# EAGLE design atmega328pb_stamp (EAGLE 7.7.0)
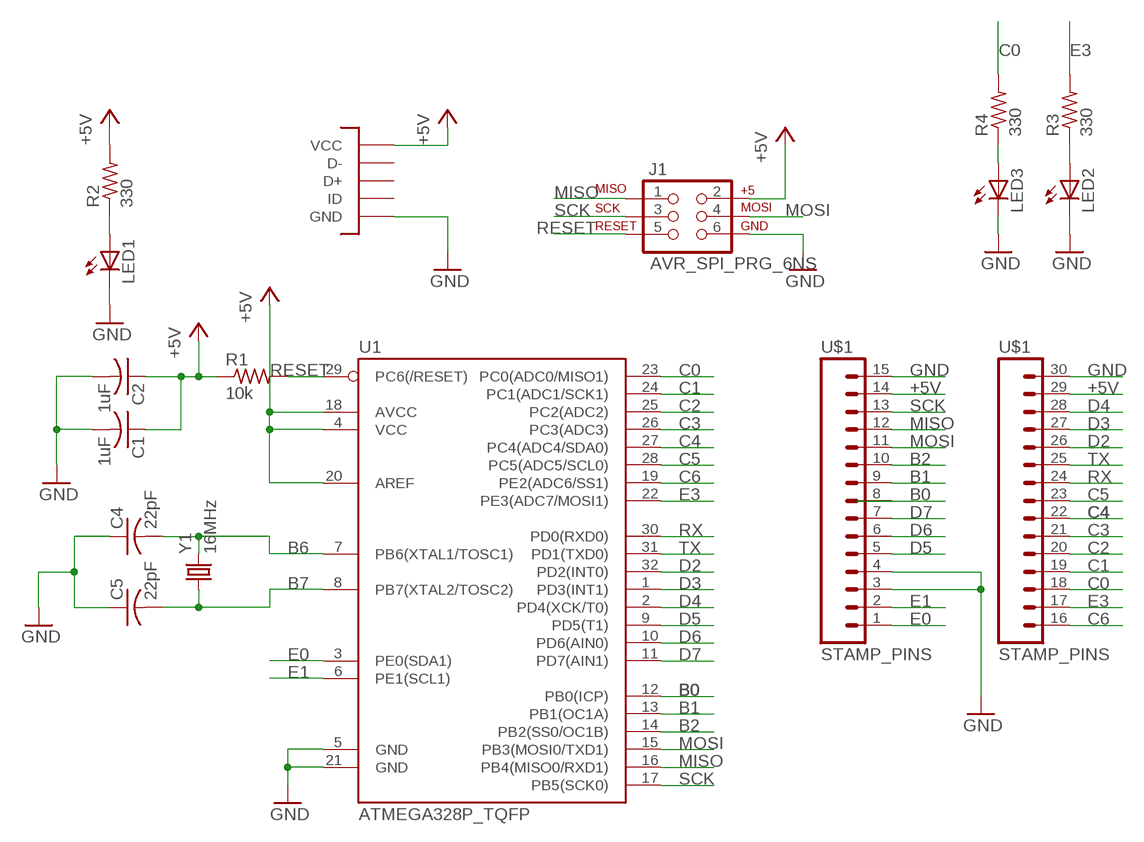
[diagram p0: schematic, sheet 1]

## Parts
C1  1uF  C-USC0603  [C0603]
C2  1uF  C-USC0603  [C0603]
C4  22pF  C-USC0603  [C0603]
C5  22pF  C-USC0603  [C0603]
J1  AVR_SPI_PRG_6NS  [2X3-NS]
LED1  LEDSML0603  [SML0603]
LED2  LEDSML0603  [SML0603]
LED3  LEDSML0603  [SML0603]
R1  10k  R-US_R0603  [R0603]
R2  330  R-US_R0603  [R0603]
R3  330  R-US_R0603  [R0603]
R4  330  R-US_R0603  [R0603]
U1  ATMEGA328P_TQFP  ATMEGA328PB_TQFP  [TQFP32-08]
U$1  STAMP_PINS  [STAMP_PINS]
U$5  MICROUSB  [MICRO_B]
Y1  16MHz  CRYSTAL3.2X1.5MM  [CRYSTAL-SMD-3.2X1.5MM]

## Nets
+5V: C1.1 C2.1 J1.2 R1.1 R2.2 U1.4(VCC) U1.18(AVCC) U1.20(AREF) U$1.14 U$1.29 U$5.P1(VCC)
B0: U1.12(PB0(ICP)) U$1.8
B1: U1.13(PB1(OC1A)) U$1.9
B2: U1.14(PB2(SS0/OC1B)) U$1.10
B6: C4.2 U1.7(PB6(XTAL1/TOSC1)) Y1.P$2
B7: C5.2 U1.8(PB7(XTAL2/TOSC2)) Y1.P$1
C0: R4.2 U1.23(PC0(ADC0/MISO1)) U$1.18
C1: U1.24(PC1(ADC1/SCK1)) U$1.19
C2: U1.25(PC2(ADC2)) U$1.20
C3: U1.26(PC3(ADC3)) U$1.21
C4: U1.27(PC4(ADC4/SDA0)) U$1.22
C5: U1.28(PC5(ADC5/SCL0)) U$1.23
C6: U1.19(PE2(ADC6/SS1)) U$1.16
D2: U1.32(PD2(INT0)) U$1.26
D3: U1.1(PD3(INT1)) U$1.27
D4: U1.2(PD4(XCK/T0)) U$1.28
D5: U1.9(PD5(T1)) U$1.5
D6: U1.10(PD6(AIN0)) U$1.6
D7: U1.11(PD7(AIN1)) U$1.7
E0: U1.3(PE0(SDA1)) U$1.1
E1: U1.6(PE1(SCL1)) U$1.2
E3: R3.2 U1.22(PE3(ADC7/MOSI1)) U$1.17
GND: C1.2 C2.2 C4.1 C5.1 J1.6 LED1.C LED2.C LED3.C U1.5(GND) U1.21(GND) U$1.3 U$1.4 U$1.15 U$1.30 U$5.GND1(GND) U$5.GND2(GND) U$5.GND3(GND) U$5.GND4(GND) U$5.GND7(GND) U$5.GND8(GND) U$5.P5(GND)
MISO: J1.1 U1.16(PB4(MISO0/RXD1)) U$1.12
MOSI: J1.4 U1.15(PB3(MOSI0/TXD1)) U$1.11
N$1: LED1.A R2.1
N$6: LED2.A R3.1
N$7: LED3.A R4.1
RESET: J1.5 R1.2 U1.29(PC6(/RESET))
RX: U1.30(PD0(RXD0)) U$1.24
SCK: J1.3 U1.17(PB5(SCK0)) U$1.13
TX: U1.31(PD1(TXD0)) U$1.25
Unconnected: U$5.P2(D-) U$5.P3(D+) U$5.P4(ID)

## Library data of the parts
C1 C2 C4 C5 = rcl:C-US: CAPACITOR, American symbol
J1 = SparkFun-Connectors:AVR_SPI_PRG_6: AVR ISP 6 Pin This is the reduced ISP connector for AVR programming. Common on Arduino. This footprint will take up less PCB space and can be used with a 10-pin to 6-pin adapter such as SKU: BOB-08508 **Special note about "TEST_POINT" package. The stop mask is on the top side, so if you want your programming test points to be on the bottom of your board, make sure to place this package on the bottom side of the board. This also ensure that the orientation to program from the bottom side will be correct.
LED1-LED3 = led:LED: LED OSRAM: - CHIPLED LG R971, LG N971, LY N971, LG Q971, LY Q971, LO R971, LY R971 LH N974, LH R974 LS Q976, LO Q976, LY Q976 LO Q996 - Hyper CHIPLED LW Q18S LB Q993, LB Q99A, LB R99A - SideLED LS A670, LO A670, LY A670, LG A670, LP A670 LB A673, LV A673, LT A673, LW A673 LH A674 LY A675 LS A676, LA A676, LO A676, LY A676, LW A676 LS A679, LY A679, LG A679 - Hyper Micro SIDELED® LS Y876, LA Y876, LO Y876, LY Y876 LT Y87S - SmartLED LW L88C, LW L88S LB L89C, LB L89S, LG L890 LS L89K, LO L89K, LY L89K LS L896, LA L896, LO L896, LY L896 - TOPLED LS T670, LO T670, LY T670, LG T670, LP T670 LSG T670, LSP T670, LSY T670, LOP T670, LYG T670 LG T671, LOG T671, LSG T671 LB T673, LV T673, LT T673, LW T673 LH T674 LS T676, LA T676, LO T676, LY T676, LB T676, LH T676, LSB T676, LW T676 LB T67C, LV T67C, LT T67C, LS T67K, LO T67K, LY T67K, LW E67C LS E67B, LA E67B, LO E67B, LY E67B, LB E67C, LV E67C, LT E67C LW T67C LS T679, LY T679, LG T679 LS T770, LO T770, LY T770, LG T770, LP T770 LB T773, LV T773, LT T773, LW T773 LH T774 LS E675, LA E675, LY E675, LS T675 LS T776, LA T776, LO T776, LY T776, LB T776 LHGB T686 LT T68C, LB T68C - Hyper Mini TOPLED® LB M676 - Mini TOPLED Santana® LG M470 LS M47K, LO M47K, LY M47K Source: http://www.osram.convergy.de LUXEON: - LUMILED® LXK2-PW12-R00, LXK2-PW12-S00, LXK2-PW14-U00, LXK2-PW14-V00 LXK2-PM12-R00, LXK2-PM12-S00, LXK2-PM14-U00 LXK2-PE12-Q00, LXK2-PE12-R00, LXK2-PE12-S00, LXK2-PE14-T00, LXK2-PE14-U00 LXK2-PB12-K00, LXK2-PB12-L00, LXK2-PB12-M00, LXK2-PB14-N00, LXK2-PB14-P00, LXK2-PB14-Q00 LXK2-PR12-L00, LXK2-PR12-M00, LXK2-PR14-Q00, LXK2-PR14-R00 LXK2-PD12-Q00, LXK2-PD12-R00, LXK2-PD12-S00 LXK2-PH12-R00, LXK2-PH12-S00 LXK2-PL12-P00, LXK2-PL12-Q00, LXK2-PL12-R00 Source: www.luxeon.com KINGBRIGHT: KA-3528ASYC Source: www.kingbright.com
R1-R4 = resistor:R-US_: RESISTOR, American symbol
U1 = atmega328_stamp_parts:ATMEGA328PB_TQFP; PROD_ID: IC-09069
U$1 = atmega328_stamp_parts:STAMP_PINS
U$5 = Other:MICROUSB
Y1 = SparkFun-FreqCtrl:CRYSTAL: Various standard crystals. Proven footprints.; PROD_ID: XTAL-13062; VALUE: 32.768kHz

## Board
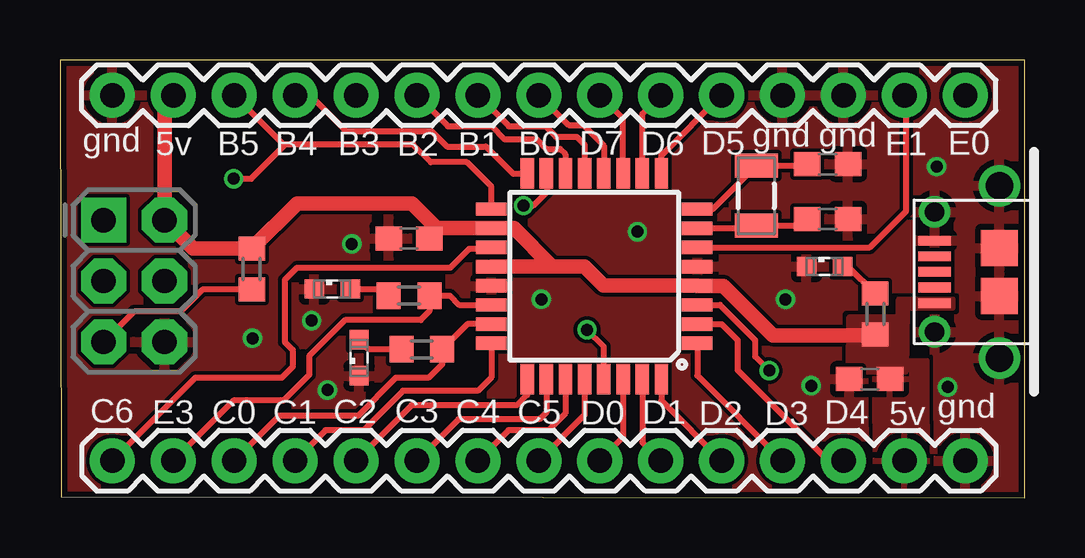
[diagram p1: board, top side]
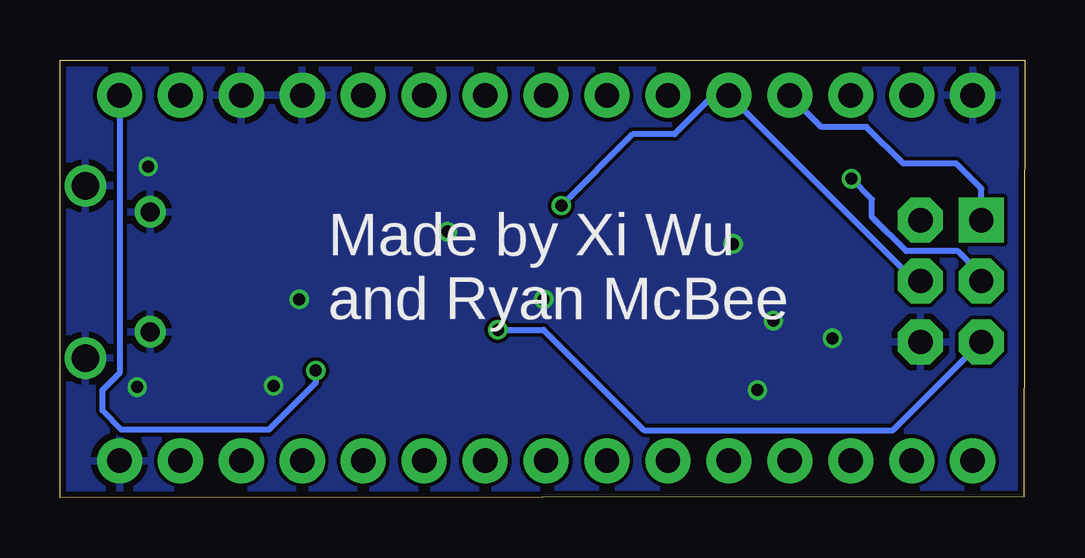
[diagram p2: board, bottom side, seen from below]

Size 40.22 x 18.26 mm. Coordinates in mm from the lower left corner, seen from the top.
Outline: 0.05,0.05 40.22,0 40.22,18.26 0,18.26 0.05,0.05
Copper layers (1*16): Top 0.035mm / dielectric 1.5mm / Bottom 0.035mm
Design rules "Elecrow_2-layer_eagle_rule": minimum track width 6mil, minimum drill 12mil, track to track 6mil, track to pad 6mil, pad to pad 6mil, via to via 6mil, smd to smd 0mil, copper to edge 10mil, drill to drill 10mil, minimum pad ring 10mil, minimum via ring 6mil, stop-mask expansion 2mil, vias tented up to drill 100mil, thermal gap 10mil

### Footprints (pad centres in the part's own frame; a part is rotated, then mirrored left to right if it is on the bottom)
C0603 = smd 1.1 x 1: 1 -0.85,0; 2 0.85,0
2X3-NS = drill 1.016 pad 1.88 square: 1 -2.54,-1.27 | drill 1.016 pad 1.88 octagon: 2 -2.54,1.27; 3 0,-1.27; 4 0,1.27; 5 2.54,-1.27; 6 2.54,1.27
SML0603 = smd 0.8 x 0.8: A 0.75,0; C -0.75,0
R0603 = smd 1 x 1.1: 1 -0.85,0; 2 0.85,0
TQFP32-08 = smd 1.27 x 0.559: 1 -4.293,2.8; 2 -4.293,2; 3 -4.293,1.2; 4 -4.293,0.4; 5 -4.293,-0.4; 6 -4.293,-1.2; 7 -4.293,-2; 8 -4.293,-2.8; 17 4.293,-2.8; 18 4.293,-2; 19 4.293,-1.2; 20 4.293,-0.4; 21 4.293,0.4; 22 4.293,1.2; 23 4.293,2; 24 4.293,2.8 | smd 0.559 x 1.27: 9 -2.8,-4.293; 10 -2,-4.293; 11 -1.2,-4.293; 12 -0.4,-4.293; 13 0.4,-4.293; 14 1.2,-4.293; 15 2,-4.293; 16 2.8,-4.293; 25 2.8,4.293; 26 2,4.293; 27 1.2,4.293; 28 0.4,4.293; 29 -0.4,4.293; 30 -1.2,4.293; 31 -2,4.293; 32 -2.8,4.293
STAMP_PINS = drill 1.016 pad 1.88: 1 0,0; 2 2.54,0; 3 5.08,0; 4 7.62,0; 5 10.16,0; 6 12.7,0; 7 15.24,0; 8 17.78,0; 9 20.32,0; 10 22.86,0; 11 25.4,0; 12 27.94,0; 13 30.48,0; 14 33.02,0; 15 35.56,0; 16 35.56,15.24; 17 33.02,15.24; 18 30.48,15.24; 19 27.94,15.24; 20 25.4,15.24; 21 22.86,15.24; 22 20.32,15.24; 23 17.78,15.24; 24 15.24,15.24; 25 12.7,15.24; 26 10.16,15.24; 27 7.62,15.24; 28 5.08,15.24; 29 2.54,15.24; 30 0,15.24
MICRO_B = smd 1.5 x 1.55: GND1 -1,1.45; GND2 1,1.45 | drill 0.8: GND3 -2.5,4.15; GND4 2.5,4.15 | drill 1.15: GND7 -3.598,1.45; GND8 3.598,1.45 | smd 0.4 x 1.35: P1 -1.3,4.15; P2 -0.65,4.15; P3 0,4.15; P4 0.65,4.15; P5 1.3,4.15
CRYSTAL-SMD-3.2X1.5MM = smd 1 x 1.8: P$1 -1.25,0; P$2 1.25,0

### Placement (x,y rotation side)
C1  14.55,10.82 180 top
C2  33.75,4.95 180 top
C4  32,11.63 180 top
C5  32,13.92 180 top
J1  3.09,9.04 270 top
LED1  31.87,9.65 0 top
LED2  11.35,8.71 0 top
LED3  12.47,5.84 90 top
R1  8,9.54 270 top
R2  33.98,7.67 270 top
R3  14.55,8.43 0 top
R4  15.08,6.2 0 top
U1  22.27,9.24 180 top
U$1  37.74,16.79 180 top
U$5  40.61,9.42 90 top
Y1  29.03,12.6 270 top

### Tracks (layer width: path | path; a pad name or v marks a point on that pad's centre or on a via)
+5V
  Top 0.61: U1.20 20.52,9.64 | 20.52,9.64 21.87,9.64 22.65,8.86 26.55,8.86 U1.4 27.65,8.84 29.72,6.78 33.94,6.78 R2.2 | 20.52,9.64 18.92,11.24 U1.18 15.83,11.25 15.76,11.18 | U$1.14 4.36,16.42 J1.2 5.55,10.39 R1.1 9.88,12.27 14.68,12.27 15.76,11.18 | 15.76,11.18 C1.1
  pour Top: 33.98,5.71 36.12,5.71 36.14,0.46 34.01,0.46
  pour Top (rank 2, no thermals): 34.97,8.28 37.21,8.28 37.21,7.92 35.3,7.92 35.25,5.26 32.89,5.26 32.92,7.54 34.97,7.54
B0
  Top 0.254: U$1.8 21.21,15.54 21.82,15.54 22.67,14.69 U1.12
B1
  Top 0.254: U$1.9 18.72,15.49 20.24,15.49 20.67,15.06 21.54,15.06 21.87,14.72 U1.13
B2
  Top 0.254: U$1.10 16.18,15.49 18.01,15.49 18.54,14.96 19.89,14.96 20.29,14.55 20.85,14.55 21.07,14.33 U1.14
B6
  Top 0.254: U1.7 28.93,11.24 Y1.P$2 30.87,11.35 C4.2
B7
  Top 0.254: U1.8 27.23,12.04 Y1.P$1 31.08,13.85 C5.2
C0
  Top 0.254: U1.23 16.98,7.24 R4.2 15.93,5.57 15.36,5 13.99,5 12.42,3.43 9.14,3.43 U$1.18
C1
  Top 0.254: U1.24 17.98,5.03 17.42,4.47 14.3,4.47 12.65,2.82 11.07,2.82 U$1.19
C2
  Top 0.254: U1.25 19.47,4.28 19.05,3.86 14.65,3.86 U$1.20
C3
  Top 0.254: U1.26 20.27,3.56 19.99,3.27 16.61,3.27 U$1.21
C4
  Top 0.254: U1.27 21.07,3.52 20.37,2.82 18.69,2.82 U$1.22
C5
  Top 0.254: U1.28 21.87,3.46 U$1.23
C6
  Top 0.254: U$1.16 5.64,5 9.24,5 9.7,5.46 9.7,6.17 9.37,6.5 9.37,9.09 9.88,9.6 16.28,9.6 17.07,10.39 17.92,10.39 U1.19
D2
  Top 0.254: U1.32 25.07,4.06 U$1.26
D3
  Top 0.254: U1.1 26.57,5.1 U$1.27
D4
  Top 0.254: U1.2 27.57,7.24 28.24,6.58 28.24,5.33 32.15,1.42 32.53,1.42 U$1.28
D5
  Top 0.254: U1.9 25.07,14.28 U$1.5
D6
  Top 0.254: U1.10 24.27,16.02 U$1.6
D7
  Top 0.254: U1.11 23.47,15.82 U$1.7
E0  (via drill 0.5)
  Top 0.254: U1.3 27.51,8.04 28.98,6.58 28.98,5.89 v29.56,5.31
  Bottom 0.254: v29.56,5.31 29.56,4.8 31.52,2.84 37.67,2.84 38.45,3.63 38.45,4.49 37.72,5.23 37.72,16.76 U$1.1
E1
  Top 0.254: U1.6 33.76,10.44 35.28,11.96 35.28,16.71 U$1.2
E3
  Top 0.254: U1.22 16.63,8.05 16.25,8.43 R3.2 15.4,7.78 15.03,7.41 11.88,7.41 10.39,5.92 10.39,5.13 9.32,4.06 7.24,4.06 U$1.17
GND  (via drill 0.5)
  other vias: 36.55,13.82 30.25,8.28 8.02,6.65 11.15,4.49 10.49,7.39 12.16,10.59 20.06,8.28 31.32,4.67 37,4.62 24.08,11.1
  pour Top (rank 6): -3.2,20.45 -2.85,-2.92 45.44,-2.31 45.39,19.12
  pour Bottom: -2.82,19.81 45.41,19.25 45.41,-2.26 -3.53,-3.13
MISO
  Top 0.254: U$1.12 10.44,16.79 11.94,15.29 15.49,15.29 16.13,14.65 17.75,14.65 18.89,13.51 19.45,13.51 U1.16
  Bottom 0.254: J1.1 1.82,12.89 2.87,13.94 5.08,13.94 6.6,15.47 8.48,15.47 U$1.12
MOSI  (via drill 0.5)
  Top 0.254: v19.33,12.19 19.73,12.19 20.32,12.77 20.32,13.49 U1.15
  Bottom 0.254: v19.33,12.19 16.35,15.16 14.6,15.16 12.98,16.79 U$1.11 4.59,9.04 J1.4
N$1
  Top 0.254: LED1.A 32.85,9.65 R2.1
N$6
  Top 0.254: LED2.A 13.42,8.71 R3.1
N$7
  Top 0.254: R4.1 12.86,6.2 LED3.A
RESET  (via drill 0.5)
  Top 0.254: U1.29 22.67,6.3 v21.97,7.01 | R1.2 5.94,8.69 5.03,7.77 3.09,7.77 J1.5
  Bottom 0.254: v21.97,7.01 20.06,7.01 15.87,2.82 5.5,2.82 J1.5
RX
  Top 0.254: U1.30 23.47,2.52 U$1.24
SCK  (via drill 0.5)
  Top 0.254: U1.17 17.98,12.98 16.96,13.99 15.47,13.99 14.73,14.73 9.4,14.73 | 9.4,14.73 9.32,14.73 U$1.13 | v7.24,13.31 7.97,13.31 9.4,14.73
  Bottom 0.254: J1.3 1.82,9.31 2.79,10.29 4.95,10.29 6.37,11.71 6.37,12.44 v7.24,13.31
TX
  Top 0.254: U1.31 24.27,2.32 U$1.25

### Text on the board
tPlace: gnd | 5v | B5 | B4 | B3 | B2 | B1 | B0 | D7 | D6 | D5 | gnd | gnd | E1 | E0 | gnd | C6 | E3 | C0 | C1 | C2 | C3 | C4 | C5 | D0 | D1 | D2 | D3 | D4 | 5v
bPlace: Made by Xi Wu / and Ryan McBee